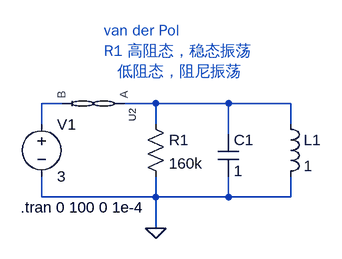
[diagram p0: schematic VanderPol.asc]
VanderPol.asc, the LTspice schematic file:
Version 4
SHEET 1 880 680
WIRE -32 80 -64 80
WIRE 112 80 64 80
WIRE 224 80 112 80
WIRE 320 80 224 80
WIRE -64 112 -64 80
WIRE 112 112 112 80
WIRE 320 112 320 80
WIRE 224 128 224 80
WIRE -64 224 -64 192
WIRE 112 224 112 192
WIRE 112 224 -64 224
WIRE 224 224 224 192
WIRE 224 224 112 224
WIRE 320 224 320 192
WIRE 320 224 224 224
WIRE 112 272 112 224
FLAG 112 272 0
SYMBOL ind 304 96 R0
SYMATTR InstName L1
SYMATTR Value 1
SYMBOL cap 208 128 R0
SYMATTR InstName C1
SYMATTR Value 1
SYMBOL res 96 96 R0
SYMATTR InstName R1
SYMATTR Value 160k
SYMBOL voltage -64 96 R0
WINDOW 123 0 0 Left 0
WINDOW 39 0 0 Left 0
SYMATTR InstName V1
SYMATTR Value 3
SYMBOL memristor_neural 16 80 R90
SYMATTR InstName U2
TEXT -96 240 Left 2 !.tran 0 100 0 1e-4
TEXT 32 -32 Left 2 ;van der Pol\nR1 高阻态，稳态振荡\n   低阻态，阻尼振荡

The netlist it stands for:
* VanderPol.asc
L1 N002 0 1
C1 N002 0 1
R1 N002 0 160k
V1 N001 0 3
XU2 N002 N001 memristor_neural  ; pins A B
.tran 0 100 0 1e-4
* van der Pol
* R1 高阻态，稳态振荡
*    低阻态，阻尼振荡
.lib memristor_neural.sub
.backanno
.end